# EAGLE design node_captorIR (EAGLE 7.2.0)
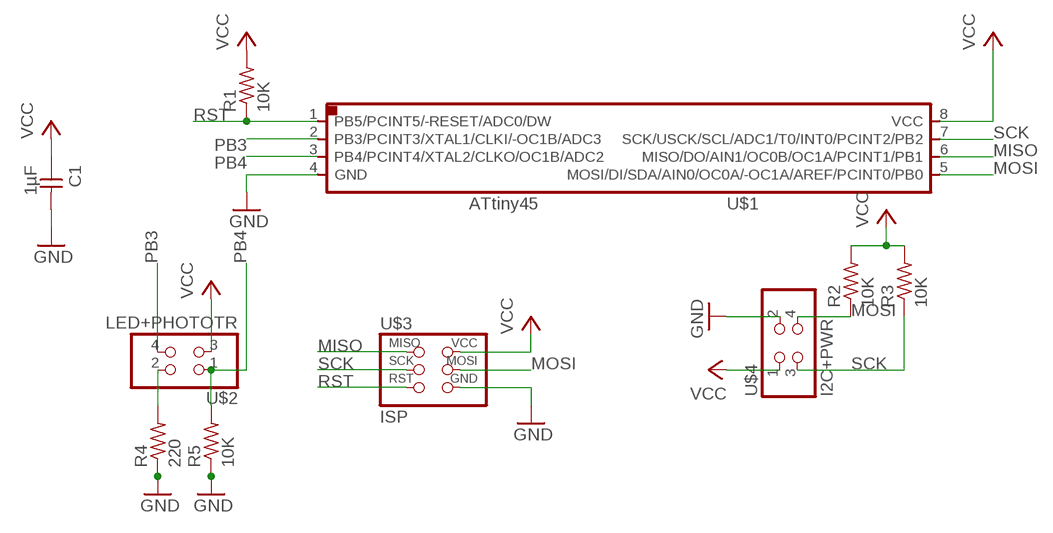
[diagram p0: schematic, sheet 1]

## Parts
C1  1µF  CAP-UNPOLARIZEDFAB  [C1206FAB]
R1  10K  RES-US1206FAB  [R1206FAB]
R2  10K  RES-US1206FAB  [R1206FAB]
R3  10K  RES-US1206FAB  [R1206FAB]
R4  220  RES-US1206FAB  [R1206FAB]
R5  10K  RES-US1206FAB  [R1206FAB]
U$1  ATTINY45SI  [SOIC8]
U$2  LED+PHOTOTR  PINHD-2X2-SMD  [2X02SMD]
U$3  ISP  AVRISPSMD  [2X03SMD]
U$4  I2C+PWR  PINHD-2X2-SMD  [2X02SMD]

## Nets
GND: C1.2 R4.1 R5.1 U$1.4(GND) U$3.6(GND) U$4.2
MISO: U$1.6(MISO/DO/AIN1/OC0B/OC1A/PCINT1/PB1) U$3.1(MISO)
MOSI: R2.1 U$1.5(MOSI/DI/SDA/AIN0/OC0A/-OC1A/AREF/PCINT0/PB0) U$3.4(MOSI) U$4.4
N$1: R4.2 U$2.2
PB3: U$1.2(PB3/PCINT3/XTAL1/CLKI/-OC1B/ADC3) U$2.4
PB4: R5.2 U$1.3(PB4/PCINT4/XTAL2/CLKO/OC1B/ADC2) U$2.1
RST: R1.1 U$1.1(PB5/PCINT5/-RESET/ADC0/DW) U$3.5(RST)
SCK: R3.1 U$1.7(SCK/USCK/SCL/ADC1/T0/INT0/PCINT2/PB2) U$3.3(SCK) U$4.3
VCC: C1.1 R1.2 R2.2 R3.2 U$1.8(VCC) U$2.3 U$3.2(VCC) U$4.1

## Library data of the parts
C1 = fab:CAP-UNPOLARIZED
R1-R5 = fab:RES-US: Resistor (US Symbol) Variants with postfix FAB are widened to allow the routing of internal traces
U$1 = fab2:ATTINY45
U$2 U$4 = fab:PINHD-2X2-SMD
U$3 = fab:AVRISP

## Board
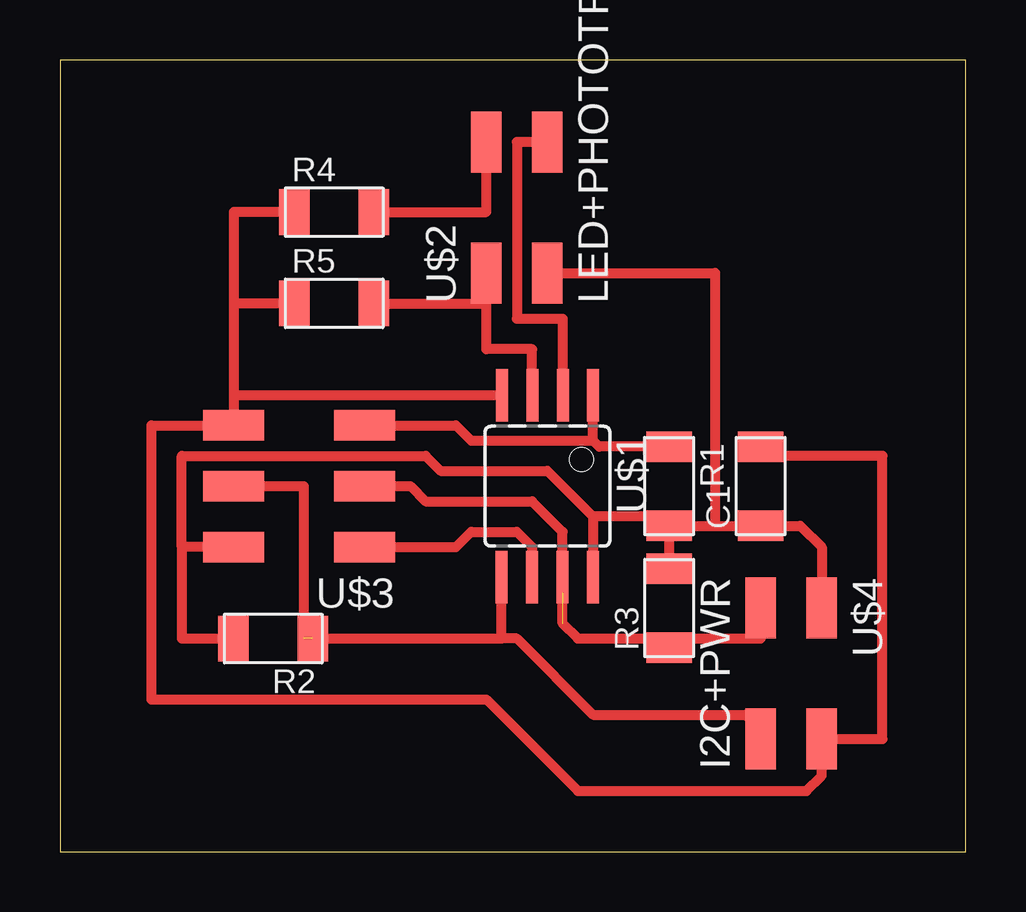
[diagram p1: board, top side]

Size 37.77 x 33.01 mm. Coordinates in mm from the lower left corner, seen from the top.
Outline: 0,0 37.77,0 37.77,33.01 0,33.01 0,0
Copper layers (1*16): Top 0.035mm / dielectric 1.5mm / Bottom 0.035mm
Design rules "default": minimum track width 10mil, minimum drill 24mil, track to track 8mil, track to pad 8mil, pad to pad 8mil, via to via 8mil, smd to smd 8mil, copper to edge 40mil, drill to drill 8mil, minimum pad ring 10mil, minimum via ring 8mil, stop-mask expansion 4mil, vias tented up to drill 0mil, thermal gap 10mil

### Footprints (pad centres in the part's own frame; a part is rotated, then mirrored left to right if it is on the bottom)
C1206FAB = smd 1.27 x 1.905: 1 -1.651,0; 2 1.651,0
R1206FAB = smd 1.27 x 1.905: 1 -1.651,0; 2 1.651,0
SOIC8 = smd 0.5 x 2.2: 1 -1.905,-3.789; 2 -0.645,-3.789; 3 0.625,-3.789; 4 1.895,-3.789; 5 1.905,3.789; 6 0.635,3.789; 7 -0.635,3.789; 8 -1.905,3.789
2X02SMD = smd 2.54 x 1.27: 1 -2.54,1.27; 2 2.92,1.27; 3 -2.54,-1.27; 4 2.92,-1.27
2X03SMD = smd 2.54 x 1.27: 1 -2.54,2.54; 2 2.92,2.54; 3 -2.54,0; 4 2.92,0; 5 -2.54,-2.54; 6 2.92,-2.54

### Placement (x,y rotation side)
C1  29.21,15.24 90 top
R1  25.4,15.24 270 top
R2  8.89,8.89 180 top
R3  25.4,10.16 90 top
R4  11.43,26.67 0 top
R5  11.43,22.86 0 top
U$1  20.32,15.24 180 top
U$2  19.05,26.67 90 top
U$3  10.16,15.24 180 top
U$4  30.48,7.62 270 top

### Tracks (layer width: path | path; a pad name or v marks a point on that pad's centre or on a via)
GND
  Top 0.406: C1.2 29.21,16.51 34.29,16.51 34.29,4.7 U$4.2 31.75,3.18 31.11,2.54 21.59,2.54 17.78,6.35 3.81,6.35 3.81,17.78 U$3.6 | U$1.4 7.24,19.03 U$3.6 | R4.1 7.24,26.67 7.24,22.86 | 7.24,22.86 U$3.6 | R5.1 7.24,22.86
MISO
  Top 0.406: U$3.1 16.51,12.7 17.14,13.34 19.05,13.34 19.68,12.7 U$1.6
MOSI  (1 unrouted)
  Top 0.406: U$3.4 10.16,15.24 10.16,8.89 18.41,8.89 | 18.41,8.89 19.05,8.89 22.22,5.71 28.57,5.71 29.21,5.08 U$4.4 | 18.41,8.89 U$1.5
N$1
  Top 0.406: R4.2 17.78,26.67 U$2.2
PB3
  Top 0.406: U$2.4 19.05,29.59 19.05,22.23 20.96,22.23 20.96,19.68 U$1.2
PB4
  Top 0.406: U$1.3 19.68,20.96 17.78,20.96 17.78,22.86 | 17.78,22.86 U$2.1 | R5.2 17.78,22.86
RST
  Top 0.406: U$3.5 16.51,17.78 17.14,17.14 22.22,17.14 | 22.22,17.14 U$1.1 | R1.1 22.48,16.89 22.22,17.14
SCK  (1 unrouted)
  Top 0.406: U$3.3 14.6,15.24 15.24,14.61 19.68,14.61 20.96,13.34 20.96,9.53 21.59,8.89 25.4,8.89 | 20.96,10.79 U$1.7 | 25.4,8.89 R3.1 | 25.4,8.89 29.21,8.89 U$4.3
VCC
  Top 0.406: U$3.2 5.08,12.7 | 5.08,12.7 5.08,16.51 15.24,16.51 15.87,15.88 20.32,15.88 22.22,13.97 | 22.22,13.97 U$1.8 | R1.2 25.4,13.97 22.22,13.97 | R1.2 27.3,13.59 | 27.3,13.59 C1.1 30.86,13.59 31.75,12.7 U$4.1 | R3.2 R1.2 | 5.08,12.7 5.08,8.89 R2.2 | U$2.3 27.3,24.13 27.3,13.59